# Altium schematic sheet Battery.SchDoc
size A
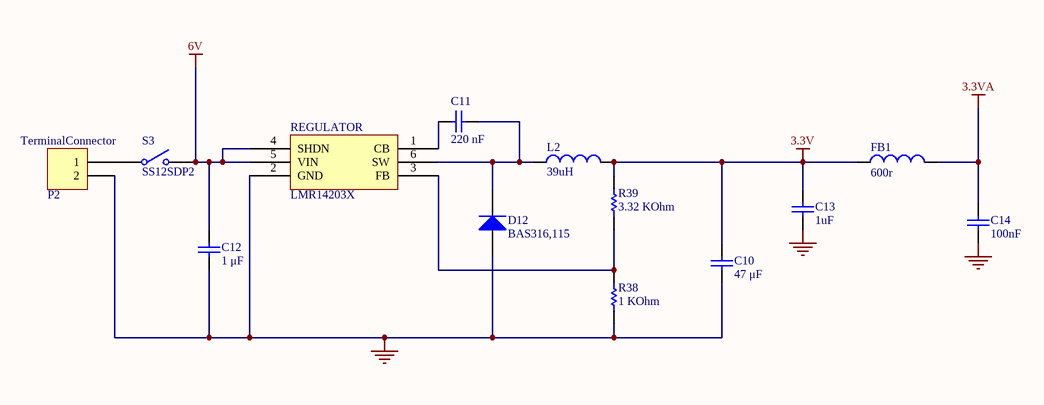
[diagram p0: Battery.SchDoc]

## Parts
C10  47 μF  [Capacitor]
C11  220 nF  [Capacitor]
C12  1 μF  [Capacitor]
C13  1uF  [Capacitor]
C14  100nF  [Capacitor]
D12  BAS316,115  [Didode (Regulator)]
FB1  value 600r  [Inductor]  (hidden comment: Comment)
L2  39uH  [Inductor (regulator)]
P2  TerminalConnector  [TerminalConector]
R38  1 KOhm  [Resistor0603]
R39  3.32 KOhm  [Resistor0603]
REGULATOR  LMR14203X  [REGULATOR]
S3  SS12SDP2  [Switch]

## Nets
3.3V: C10.2 C13.2 FB1.1 L2.2 R39.2
3.3VA: C14.2 FB1.2
6V: C12.2 REGULATOR.4(SHDN) REGULATOR.5(VIN) S3.2(NO)
GND: C10.1 C12.1 C13.1 C14.1 D12.1(A) P2.2 R38.1 REGULATOR.2(GND)
NetC11_1: C11.1 D12.2(K) L2.1 REGULATOR.6(SW)
NetC11_2: C11.2 REGULATOR.1(CB)
NetP2_1: P2.1 S3.1(COMMON)
NetR38_2: R38.2 R39.1 REGULATOR.3(FB)

## Library data of the parts
C10-C14 = Cap: Capacitor; Published: 8-Jun-2000; LatestRevisionDate: 17-Jul-2002; LatestRevisionNote: Re-released for DXP Platform.; PackageReference: RAD-0.3; Publisher: Altium Limited; PackageDescription: Radial Cap, Thru-Hole; 2 Leads; 0.3 in Pin Spacing
  C10: Value: 47 μF
  C11: Value: 220 nF
  C12: Value: 1 μF
  C13: Value: 1uF
  C14: Value: 100nF
D12 = Diode: Default Diode; Published: 8-Jun-2000; LatestRevisionDate: 17-Jul-2002; LatestRevisionNote: Re-released for DXP Platform.; PackageVersion: Sep-1996; PackageReference: SMC; Publisher: Altium Limited; PackageDescription: DO-214-AB/SMC; 2 C-Bend Leads; Body 7.9 x 5.9 mm, inc. leads (LxW); Code_JEDEC: DO-214-AB; Farnell Reference: 8734275
FB1 = Inductor: Code_IEC: 1005; Published: 8-Jun-2000; LatestRevisionDate: 29-May-2009; LatestRevisionNote: IPC-7351 Footprint Added.; PackageReference: 0402-A; Publisher: Altium Limited; PackageDescription: Chip Inductor; Code_JEITA: 0402
L2 = Inductor: FabricantReference: 744773139; Fabricant: WURTH ELECTRONIK; Published: 8-Jun-2000; LatestRevisionDate: 29-May-2009; LatestRevisionNote: IPC-7351 Footprint Added.; Publisher: Altium Limited; PackageDescription: Chip Inductor; Value: 39uH; Farnell Reference: 2082620
P2 = Header 2H: Header, 2-Pin, Right Angle; LatestRevisionDate: 17-Jul-2002; LatestRevisionNote: Re-released for DXP Platform.; Publisher: Altium Limited
R38 R39 = Res1: Resistor; Published: 8-Jun-2000; LatestRevisionDate: 17-Jul-2002; LatestRevisionNote: Re-released for DXP Platform.; PackageReference: AXIAL-0.3; Publisher: Altium Limited; PackageDescription: Axial Device, Thru-Hole; 2 Leads; 0.3 in Pin Spacing
  R38: Value: 1 KOhm
  R39: Value: 3.32 KOhm
REGULATOR = Regulator: Farnell Reference: 2064680
S3 = SW-SPST: Single-Pole, Single-Throw Switch; Published: 24-Mar-1999; LatestRevisionDate: 17-Jul-2002; LatestRevisionNote: Re-released for DXP Platform.; PackageReference: SPST-2; Publisher: Altium Limited; PackageDescription: Switch; 2 Leads; Farnell Reference: 1524325